# EAGLE design Controller_Keinz_2022 (EAGLE 9.4.2)

## Sheet 1 of 3
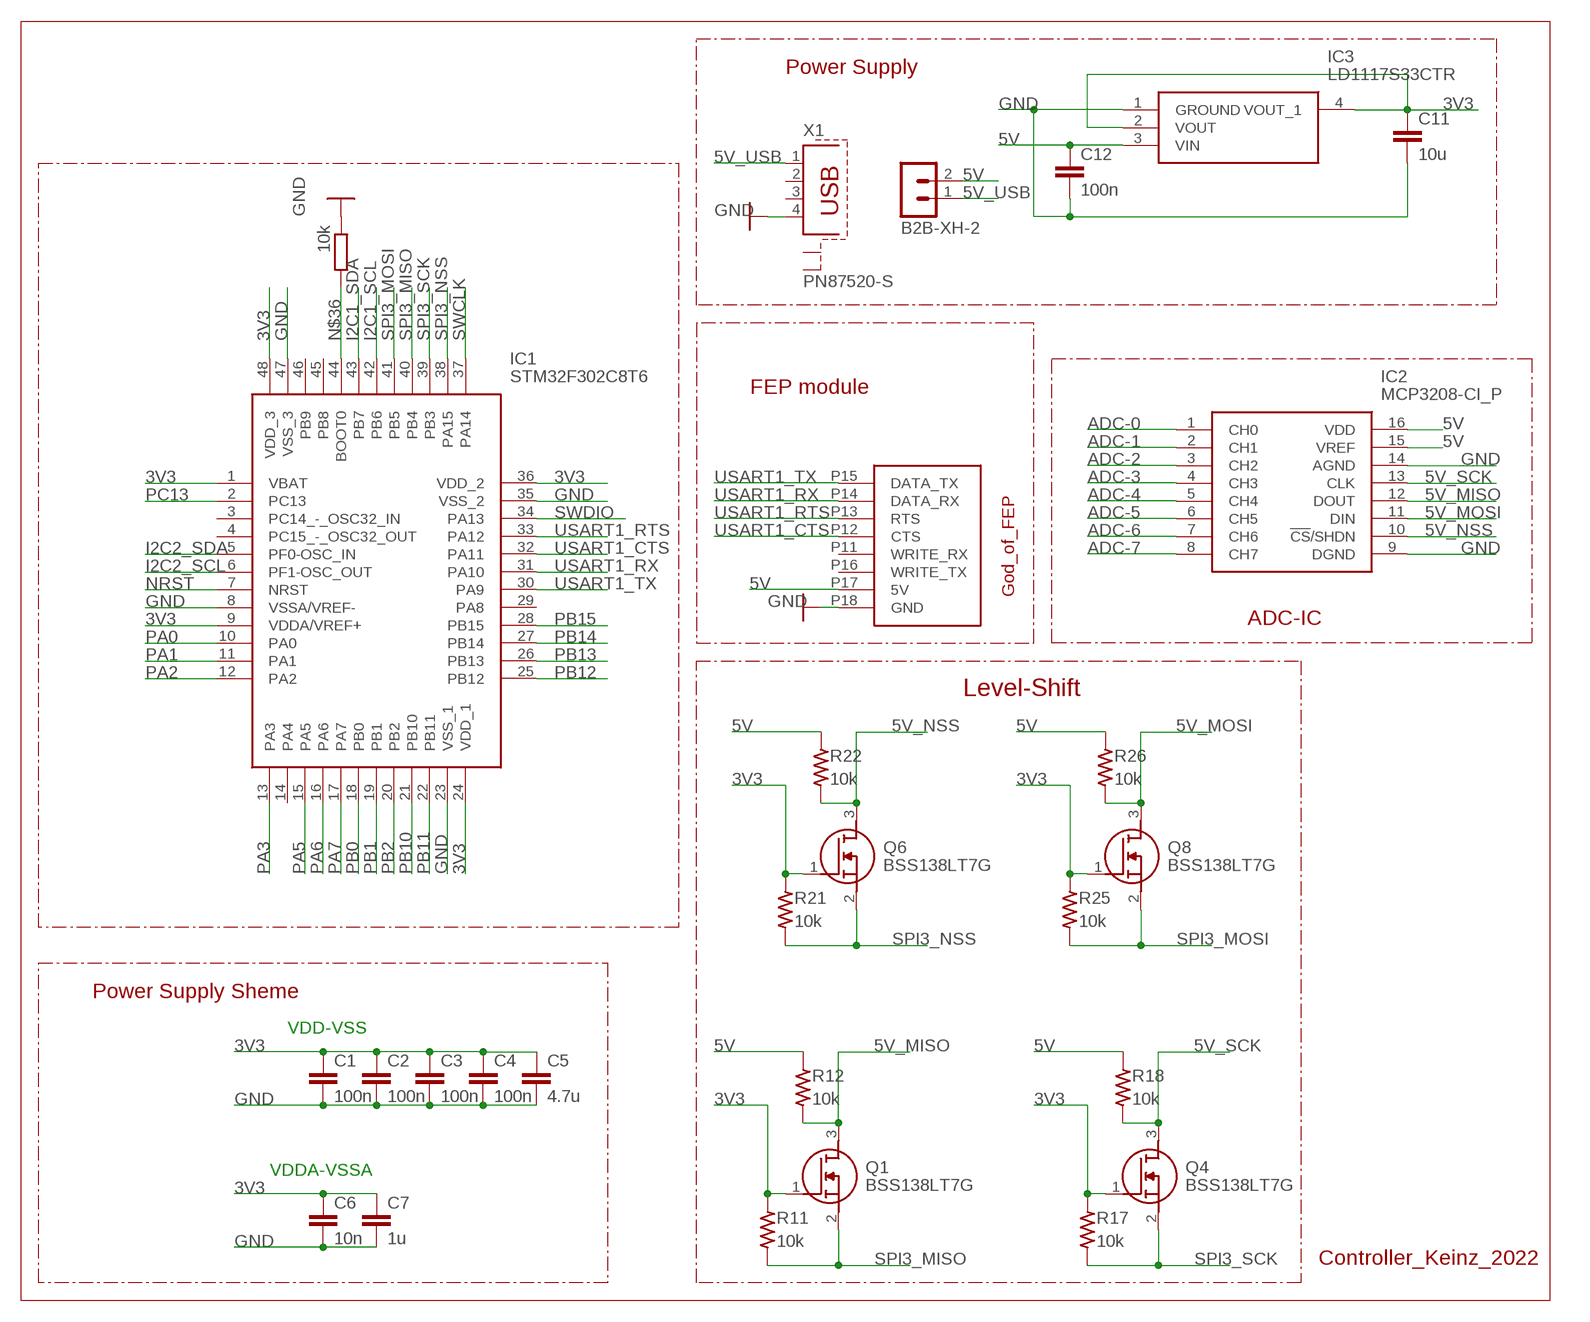
[diagram p0: schematic, sheet 1]

### Parts
C1  100n  C-EUC0603K  [C0603K]
C2  100n  C-EUC0603K  [C0603K]
C3  100n  C-EUC0603K  [C0603K]
C4  100n  C-EUC0603K  [C0603K]
C5  4.7u  C-EUC0603K  [C0603K]
C6  10n  C-EUC0603K  [C0603K]
C7  1u  C-EUC0603K  [C0603K]
C11  10u  C-EUC0603K  [C0603K]
C12  100n  C-EUC0603K  [C0603K]
FEP_1  GOD_OF_FEP  [GOD_OF_FEP]
IC1  STM32F302C8T6  [QFP50P900X900X160-48N]
IC2  MCP3208-CI_P  [DIP781W56P254L1918H533Q16N]
IC3  LD1117S33CTR  [SOT230P700X190-4N]
Q1  BSS138LT7G  [SOT96P237X111-3N]
Q4  BSS138LT7G  [SOT96P237X111-3N]
Q6  BSS138LT7G  [SOT96P237X111-3N]
Q8  BSS138LT7G  [SOT96P237X111-3N]
R8  10k  R-EU_R0603  [R0603@1]
R11  10k  RESISTOR-US1608  [SMD1608]
R12  10k  RESISTOR-US1608  [SMD1608]
R17  10k  RESISTOR-US1608  [SMD1608]
R18  10k  RESISTOR-US1608  [SMD1608]
R21  10k  RESISTOR-US1608  [SMD1608]
R22  10k  RESISTOR-US1608  [SMD1608]
R25  10k  RESISTOR-US1608  [SMD1608]
R26  10k  RESISTOR-US1608  [SMD1608]
X1  PN87520-S  [PN87520-S]
X22  B2B-XH-2  [B2B-XH-A]

### Nets
3V3: C1.1 C2.1 C3.1 C4.1 C5.1 C6.1 C7.1 C11.1 IC1.1(VBAT) IC1.9(VDDA/VREF+) IC1.24(VDD_1) IC1.36(VDD_2) IC1.48(VDD_3) IC3.2(VOUT) IC3.4(VOUT_1) Q1.1(G) Q4.1(G) Q6.1(G) Q8.1(G) R11.1 R17.1 R21.1 R25.1 ; also sheet 2,3
5V: C12.1 FEP_1.P17(5V) IC2.15(VREF) IC2.16(VDD) IC3.3(VIN) R12.1 R18.1 R22.1 R26.1 X22.2 ; also sheet 2,3
5V_MISO: IC2.12(DOUT) Q1.3(D) R12.2
5V_MOSI: IC2.11(DIN) Q8.3(D) R26.2
5V_NSS: IC2.10(!CS!/SHDN) Q6.3(D) R22.2
5V_SCK: IC2.13(CLK) Q4.3(D) R18.2
5V_USB: X1.1 X22.1
ADC-0: IC2.1(CH0) ; also sheet 2
ADC-1: IC2.2(CH1) ; also sheet 2
ADC-2: IC2.3(CH2) ; also sheet 2
ADC-3: IC2.4(CH3) ; also sheet 2
ADC-4: IC2.5(CH4) ; also sheet 2
ADC-5: IC2.6(CH5) ; also sheet 2
ADC-6: IC2.7(CH6) ; also sheet 2
ADC-7: IC2.8(CH7)
GND: C1.2 C2.2 C3.2 C4.2 C5.2 C6.2 C7.2 C11.2 C12.2 FEP_1.P18(GND) IC1.8(VSSA/VREF-) IC1.23(VSS_1) IC1.35(VSS_2) IC1.47(VSS_3) IC2.9(DGND) IC2.14(AGND) IC3.1(GROUND) R8.1 X1.4 ; also sheet 2,3
I2C1_SCL: IC1.42(PB6) ; also sheet 2
I2C1_SDA: IC1.43(PB7) ; also sheet 2
I2C2_SCL: IC1.6(PF1-OSC_OUT) ; also sheet 2
I2C2_SDA: IC1.5(PF0-OSC_IN) ; also sheet 2
N$36: IC1.44(BOOT0) R8.2
NRST: IC1.7(NRST) ; also sheet 2
PA0: IC1.10(PA0) ; also sheet 2
PA1: IC1.11(PA1) ; also sheet 3
PA2: IC1.12(PA2) ; also sheet 3
PA3: IC1.13(PA3) ; also sheet 2
PA5: IC1.15(PA5) ; also sheet 2
PA6: IC1.16(PA6) ; also sheet 2
PA7: IC1.17(PA7) ; also sheet 2
PB0: IC1.18(PB0) ; also sheet 2
PB1: IC1.19(PB1) ; also sheet 2
PB2: IC1.20(PB2) ; also sheet 2
PB10: IC1.21(PB10) ; also sheet 3
PB11: IC1.22(PB11) ; also sheet 3
PB12: IC1.25(PB12) ; also sheet 2
PB13: IC1.26(PB13) ; also sheet 3
PB14: IC1.27(PB14) ; also sheet 3
PB15: IC1.28(PB15) ; also sheet 3
PC13: IC1.2(PC13) ; also sheet 2
SPI3_MISO: IC1.40(PB4) Q1.2(S) R11.2
SPI3_MOSI: IC1.41(PB5) Q8.2(S) R25.2
SPI3_NSS: IC1.38(PA15) Q6.2(S) R21.2
SPI3_SCK: IC1.39(PB3) Q4.2(S) R17.2
SWCLK: IC1.37(PA14) ; also sheet 2
SWDIO: IC1.34(PA13) ; also sheet 2
USART1_CTS: FEP_1.P12(CTS) IC1.32(PA11)
USART1_RTS: FEP_1.P13(RTS) IC1.33(PA12)
USART1_RX: FEP_1.P14(DATA_RX) IC1.31(PA10)
USART1_TX: FEP_1.P15(DATA_TX) IC1.30(PA9)
Unconnected: FEP_1.P11(WRITE_RX) FEP_1.P16(WRITE_TX) IC1.3(PC14_-_OSC32_IN) IC1.4(PC15_-_OSC32_OUT) IC1.14(PA4) IC1.29(PA8) IC1.45(PB8) IC1.46(PB9) X1.2 X1.3 X1.S1 X1.S2

### Notes on the sheet
- Power Supply
- FEP module
- ADC-IC
- Level-Shift
- Power Supply Sheme
- VDD-VSS
- VDDA-VSSA
- Controller_Keinz_2022

## Sheet 2 of 3
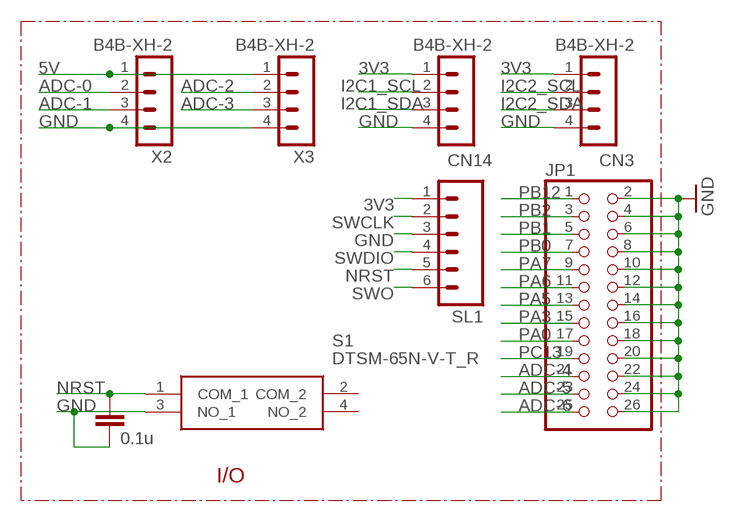
[diagram p1: schematic, sheet 2]

### Parts
C13  0.1u  C-EUC0603K  [C0603K]
CN3  B4B-XH-2  [B4B-XH-A]
CN14  B4B-XH-2  [B4B-XH-A]
JP1  PINHD-2X13  [2X13]
S1  DTSM-65N-V-T_R  [DTSM65NVTR]
SL1  MA06  [06PA]
X2  B4B-XH-2  [B4B-XH-A]
X3  B4B-XH-2  [B4B-XH-A]

### Nets
3V3: CN3.1 CN14.1 SL1.1 ; also sheet 1,3
5V: X2.1 X3.1 ; also sheet 1,3
ADC-0: X2.2 ; also sheet 1
ADC-1: X2.3 ; also sheet 1
ADC-2: X3.2 ; also sheet 1
ADC-3: X3.3 ; also sheet 1
ADC-4: JP1.21 ; also sheet 1
ADC-5: JP1.23 ; also sheet 1
ADC-6: JP1.25 ; also sheet 1
GND: C13.2 CN3.4 CN14.4 JP1.2 JP1.4 JP1.6 JP1.8 JP1.10 JP1.12 JP1.14 JP1.16 JP1.18 JP1.20 JP1.22 JP1.24 JP1.26 S1.3(NO_1) SL1.3 X2.4 X3.4 ; also sheet 1,3
I2C1_SCL: CN14.2 ; also sheet 1
I2C1_SDA: CN14.3 ; also sheet 1
I2C2_SCL: CN3.2 ; also sheet 1
I2C2_SDA: CN3.3 ; also sheet 1
NRST: C13.1 S1.1(COM_1) SL1.5 ; also sheet 1
PA0: JP1.17 ; also sheet 1
PA3: JP1.15 ; also sheet 1
PA5: JP1.13 ; also sheet 1
PA6: JP1.11 ; also sheet 1
PA7: JP1.9 ; also sheet 1
PB0: JP1.7 ; also sheet 1
PB1: JP1.5 ; also sheet 1
PB2: JP1.3 ; also sheet 1
PB12: JP1.1 ; also sheet 1
PC13: JP1.19 ; also sheet 1
SWCLK: SL1.2 ; also sheet 1
SWDIO: SL1.4 ; also sheet 1
SWO: SL1.6
Unconnected: S1.2(COM_2) S1.4(NO_2)

### Notes on the sheet
- I/O

## Sheet 3 of 3
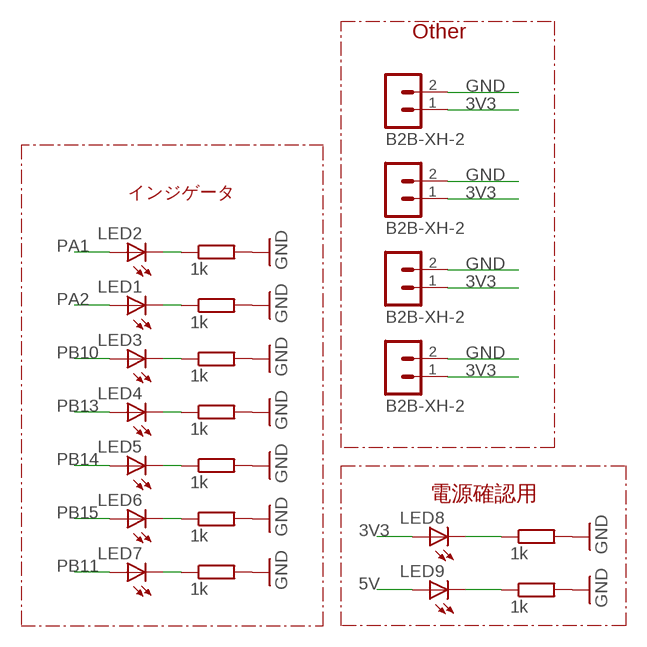
[diagram p2: schematic, sheet 3]

### Parts
LED1  LEDCHIP-LED0805  [CHIP-LED0805]
LED2  LEDCHIP-LED0805  [CHIP-LED0805]
LED3  LEDCHIP-LED0805  [CHIP-LED0805]
LED4  LEDCHIP-LED0805  [CHIP-LED0805]
LED5  LEDCHIP-LED0805  [CHIP-LED0805]
LED6  LEDCHIP-LED0805  [CHIP-LED0805]
LED7  LEDCHIP-LED0805  [CHIP-LED0805]
LED8  LEDCHIP-LED0805  [CHIP-LED0805]
LED9  LEDCHIP-LED0805  [CHIP-LED0805]
R1  1k  R-EU_R0603  [R0603@1]
R2  1k  R-EU_R0603  [R0603@1]
R3  1k  R-EU_R0603  [R0603@1]
R4  1k  R-EU_R0603  [R0603@1]
R5  1k  R-EU_R0603  [R0603@1]
R6  1k  R-EU_R0603  [R0603@1]
R7  1k  R-EU_R0603  [R0603@1]
R9  1k  R-EU_R0603  [R0603@1]
R10  1k  R-EU_R0603  [R0603@1]
X4  B2B-XH-2  [B2B-XH-A]
X5  B2B-XH-2  [B2B-XH-A]
X6  B2B-XH-2  [B2B-XH-A]
X7  B2B-XH-2  [B2B-XH-A]

### Nets
3V3: LED8.A X4.1 X5.1 X6.1 X7.1 ; also sheet 1,2
5V: LED9.A ; also sheet 1,2
GND: R1.2 R2.2 R3.2 R4.2 R5.2 R6.2 R7.2 R9.2 R10.2 X4.2 X5.2 X6.2 X7.2 ; also sheet 1,2
N$1: LED2.C R1.1
N$2: LED1.C R2.1
N$3: LED3.C R3.1
N$4: LED4.C R4.1
N$5: LED5.C R5.1
N$6: LED6.C R6.1
N$7: LED7.C R7.1
N$9: LED9.C R10.1
N$10: LED8.C R9.1
PA1: LED2.A ; also sheet 1
PA2: LED1.A ; also sheet 1
PB10: LED3.A ; also sheet 1
PB11: LED7.A ; also sheet 1
PB13: LED4.A ; also sheet 1
PB14: LED5.A ; also sheet 1
PB15: LED6.A ; also sheet 1

### Notes on the sheet
- Other
- インジゲータ
- 電源確認用

## Library data of the parts
C1-C7 C11-C13 = rcl:C-EU: CAPACITOR, European symbol
CN3 CN14 X2 X3 = JST-XH:B4B-XH: JST XH series header 2.50mm pitch disconnectable crimp style connectors, vertical (side entry type), 4 pins
FEP_1 = God_of_FEP:GOD_OF_FEP
IC1 = SamacSys_Parts:STM32F302C8T6: STMICROELECTRONICS - STM32F302C8T6 - MCU, 32BIT, CORTEX-M4, 72MHZ, LQFP-48 Source: Datasheet <http://www.st.com/content/ccc/resource/technical/document/datasheet/e4/06/d5/04/58/af/41/14/DM00093333.pdf/files/DM00093333.pdf/jcr:content/translations/en.DM00093333.pdf>; ARROW_PART_NUMBER: STM32F302C8T6; ARROW_PRICE-STOCK: https://www.arrow.com/en/products/stm32f302c8t6/stmicroelectronics; DESCRIPTION: STMICROELECTRONICS - STM32F302C8T6 - MCU, 32BIT, CORTEX-M4, 72MHZ, LQFP-48; HEIGHT: 1.6mm; MANUFACTURER_NAME: STMicroelectronics; MANUFACTURER_PART_NUMBER: STM32F302C8T6; MOUSER_PART_NUMBER: 511-STM32F302C8T6; MOUSER_PRICE-STOCK: https://www.mouser.co.uk/ProductDetail/STMicroelectronics/STM32F302C8T6?qs=F5OEftmZcCDUtHR76ET77A%3D%3D
IC2 = SamacSys_Parts:MCP3208-CI_P: A/D Converters Source: Datasheet <https://eu.mouser.com/datasheet/2/268/21298e-1101808.pdf>; ARROW_PART_NUMBER: MCP3208-CI/P; ARROW_PRICE-STOCK: https://www.arrow.com/en/products/mcp3208-cip/microchip-technology?region=europe; DESCRIPTION: A/D Converters; HEIGHT: 5.334mm; MANUFACTURER_NAME: Microchip; MANUFACTURER_PART_NUMBER: MCP3208-CI/P; MOUSER_PART_NUMBER: 579-MCP3208CIP; MOUSER_PRICE-STOCK: https://www.mouser.co.uk/ProductDetail/Microchip-Technology/MCP3208-CI-P?qs=9y3LFqDLL8IuAGJEebQX9g%3D%3D
IC3 = SamacSys_Parts:LD1117S33CTR: LD1117S33CTR, Low Dropout Voltage Regulator, 1.3A, 3.3 V +/-1%, 4-Pin SOT-223 Source: Datasheet <http://www.st.com/st-web-ui/static/active/en/resource/technical/document/datasheet/CD00000544.pdf>; ALLIED_NUMBER: 70390200; ALLIED_PRICE-STOCK: http://www.alliedelec.com/stmicroelectronics-ld1117s33ctr/70390200/; DESCRIPTION: LD1117S33CTR, Low Dropout Voltage Regulator, 1.3A, 3.3 V +/-1%, 4-Pin SOT-223; HEIGHT: 1.9mm; MANUFACTURER_NAME: STMicroelectronics; MANUFACTURER_PART_NUMBER: LD1117S33CTR; MOUSER_PART_NUMBER: 511-LD1117S33C; MOUSER_PRICE-STOCK: https://www.mouser.com/Search/Refine.aspx?Keyword=511-LD1117S33C; RS_PART_NUMBER: 6869388P; RS_PRICE-STOCK: http://uk.rs-online.com/web/p/products/6869388P
JP1 = pinhead:PINHD-2X13: PIN HEADER
LED1-LED9 = adafruit:LED: LED OSRAM: - CHIPLED LG R971, LG N971, LY N971, LG Q971, LY Q971, LO R971, LY R971 LH N974, LH R974 LS Q976, LO Q976, LY Q976 LO Q996 - Hyper CHIPLED LW Q18S LB Q993, LB Q99A, LB R99A - SideLED LS A670, LO A670, LY A670, LG A670, LP A670 LB A673, LV A673, LT A673, LW A673 LH A674 LY A675 LS A676, LA A676, LO A676, LY A676, LW A676 LS A679, LY A679, LG A679 - Hyper Micro SIDELED® LS Y876, LA Y876, LO Y876, LY Y876 LT Y87S - SmartLED LW L88C, LW L88S LB L89C, LB L89S, LG L890 LS L89K, LO L89K, LY L89K LS L896, LA L896, LO L896, LY L896 - TOPLED LS T670, LO T670, LY T670, LG T670, LP T670 LSG T670, LSP T670, LSY T670, LOP T670, LYG T670 LG T671, LOG T671, LSG T671 LB T673, LV T673, LT T673, LW T673 LH T674 LS T676, LA T676, LO T676, LY T676, LB T676, LH T676, LSB T676, LW T676 LB T67C, LV T67C, LT T67C, LS T67K, LO T67K, LY T67K, LW E67C LS E67B, LA E67B, LO E67B, LY E67B, LB E67C, LV E67C, LT E67C LW T67C LS T679, LY T679, LG T679 LS T770, LO T770, LY T770, LG T770, LP T770 LB T773, LV T773, LT T773, LW T773 LH T774 LS E675, LA E675, LY E675, LS T675 LS T776, LA T776, LO T776, LY T776, LB T776 LHGB T686 LT T68C, LB T68C - Hyper Mini TOPLED® LB M676 - Mini TOPLED Santana® LG M470 LS M47K, LO M47K, LY M47K Source: http://www.osram.convergy.de/
Q1 Q4 Q6 Q8 = SamacSys_Parts:BSS138LT7G: MOSFET Single N-Channel Logic Level Power MOSFET 50V, 200mA, 3.5 Source: Datasheet <https://www.mouser.com/datasheet/2/308/BSS138LT1-D-1522521.pdf>; ARROW_PART_NUMBER: BSS138LT7G; ARROW_PRICE-STOCK: https://www.arrow.com/en/products/bss138lt7g/on-semiconductor; DESCRIPTION: MOSFET Single N-Channel Logic Level Power MOSFET 50V, 200mA, 3.5; HEIGHT: 1.11mm; MANUFACTURER_NAME: ON Semiconductor; MANUFACTURER_PART_NUMBER: BSS138LT7G; MOUSER_PART_NUMBER: 863-BSS138LT7G; MOUSER_PRICE-STOCK: https://www.mouser.co.uk/ProductDetail/ON-Semiconductor/BSS138LT7G/?qs=l7cgNqFNU1gVGpXKtqpwiw%3D%3D
R1-R10 = rcl:R-EU_: RESISTOR, European symbol; SPICEPREFIX: R
R11 R12 R17 R18 R21 R22 R25 R26 = generic:RESISTOR-US: Generic Registor
S1 = SamacSys_Parts:DTSM-65N-V-T_R: Tactile Switches Surface Mounting Type 6*6 Source: Datasheet <https://componentsearchengine.com/Datasheets/1/DTSM-65N-V-T_R.pdf>; DESCRIPTION: Tactile Switches Surface Mounting Type 6*6; HEIGHT: 9.6mm; MANUFACTURER_NAME: Diptronics; MANUFACTURER_PART_NUMBER: DTSM-65N-V-T/R; MOUSER_PART_NUMBER: 113-DTSM-65N-V-T/R; MOUSER_PRICE-STOCK: https://www.mouser.com/Search/Refine.aspx?Keyword=113-DTSM-65N-V-T%2FR
SL1 = con-amp-quick:MA06: AMP QUICK CONNECTOR; OC_FARNELL: unknown; OC_NEWARK: unknown
X1 = con-berg:PN87520-S; OC_FARNELL: unknown; OC_NEWARK: unknown
X4-X7 X22 = con-JST_XH:B2B-XH: JST XH series header 2.50mm pitch disconnectable crimp style connectors, vertical (side entry type), 2 pins

## Board
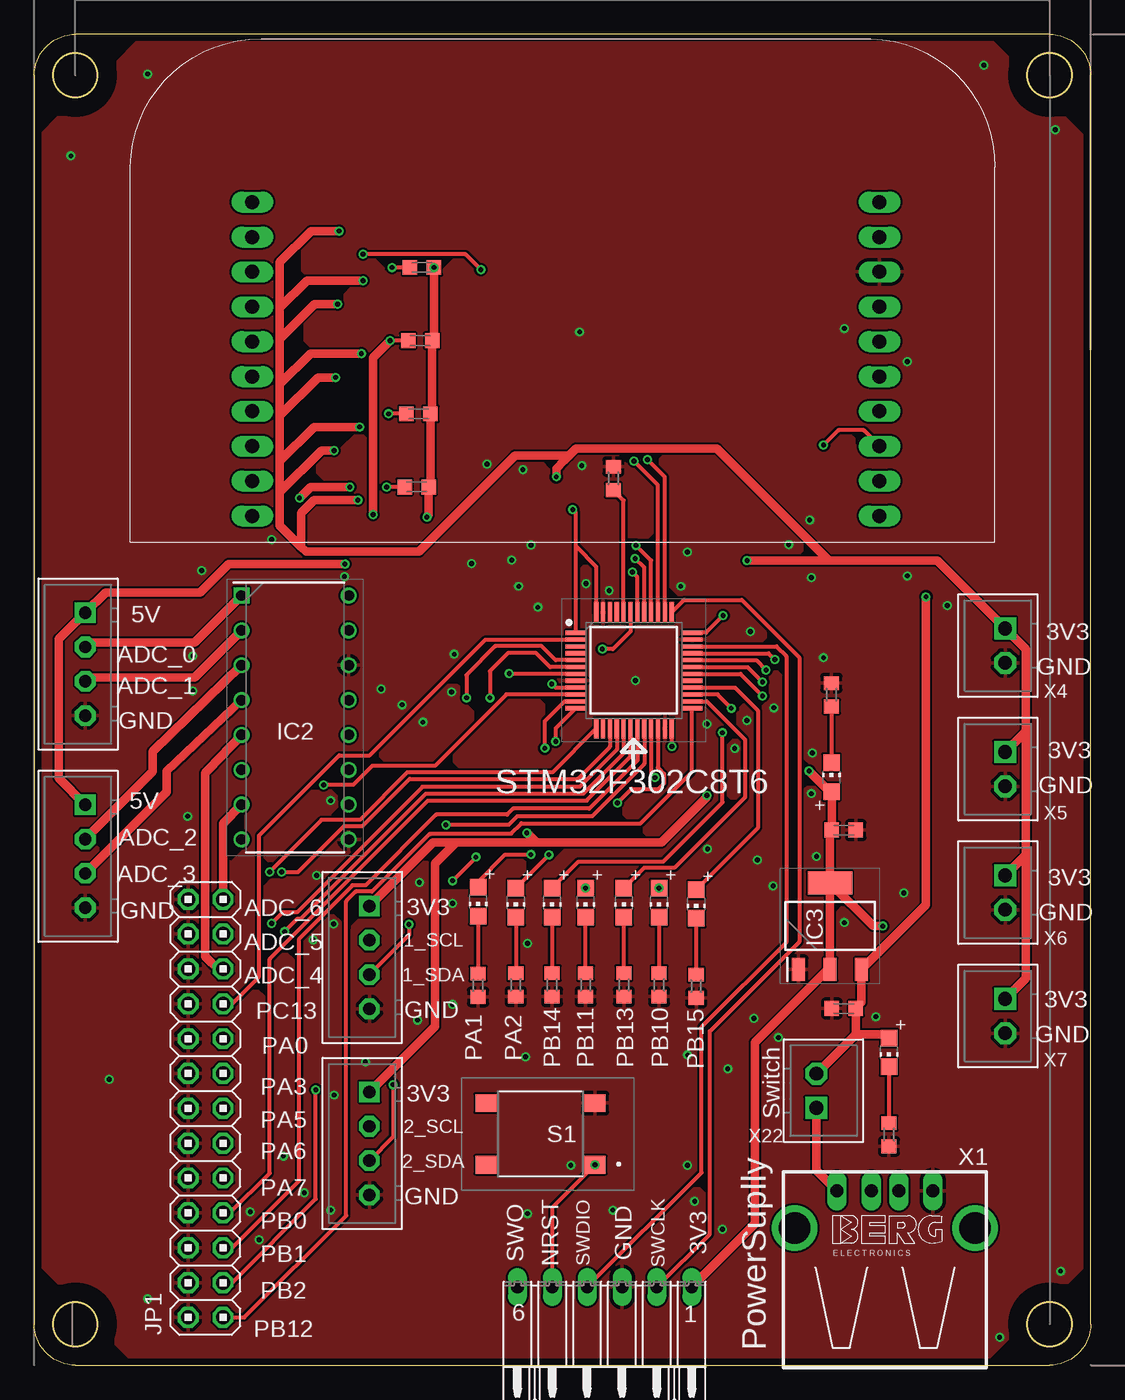
[diagram p3: board, top side]
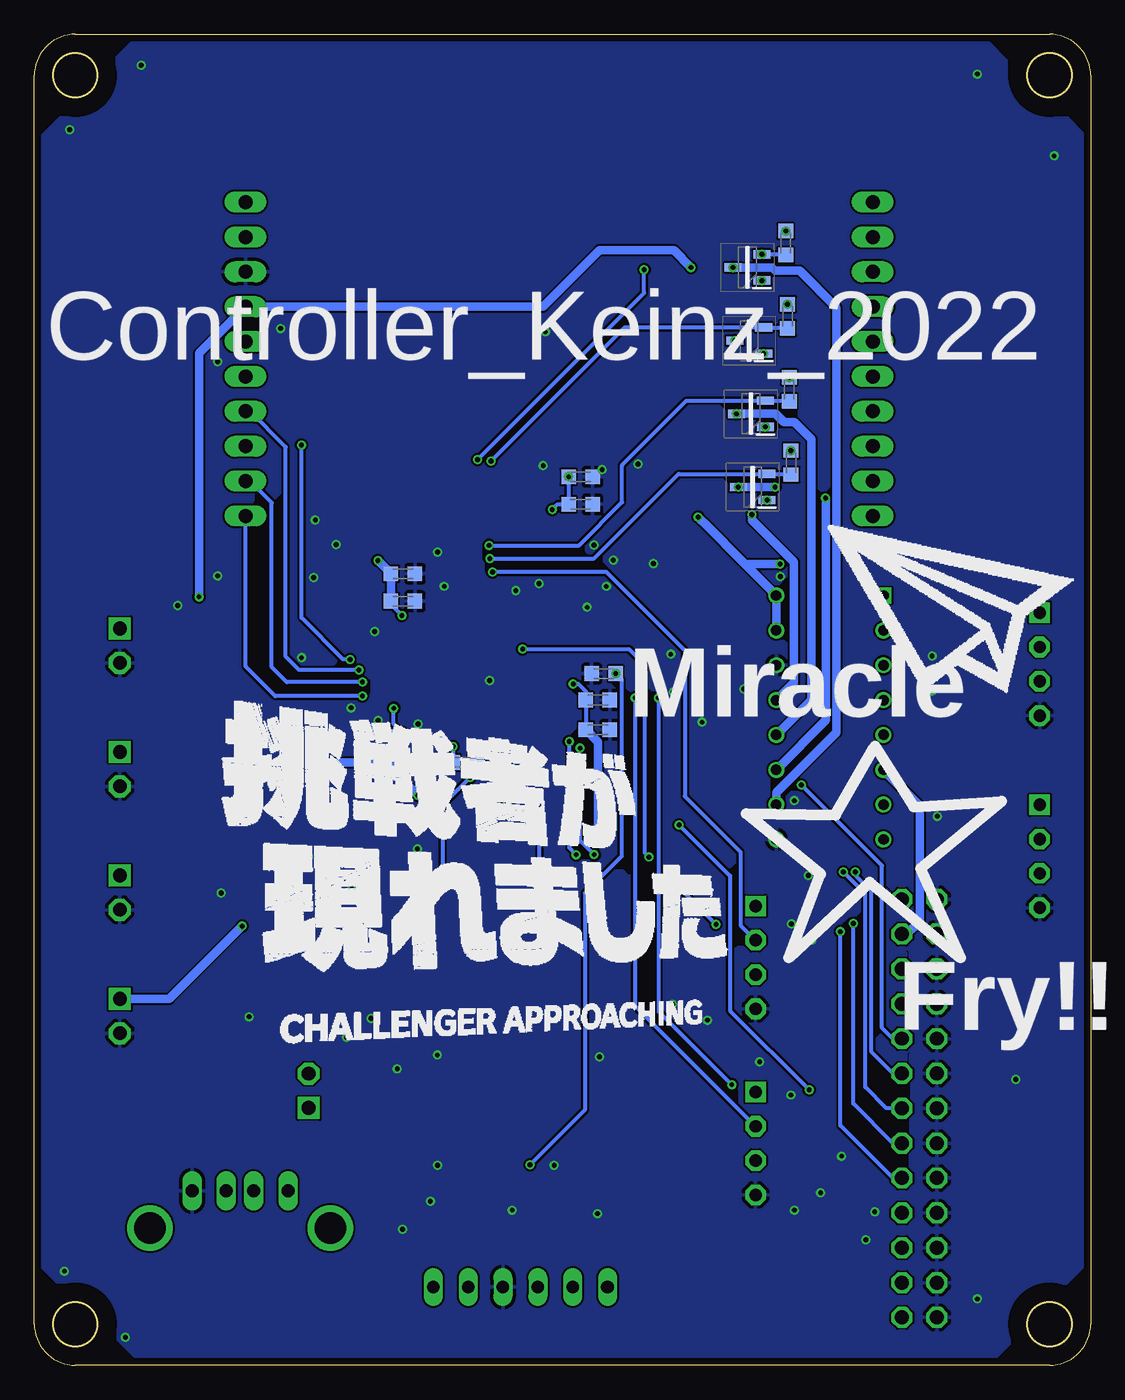
[diagram p4: board, bottom side, seen from below]

Size 77 x 97 mm. Coordinates in mm from the lower left corner, seen from the top.
Outline: 3,0 74,0 arc90 77,3 77,94 arc90 74,97 3,97 arc90 0,94 0,3 arc90 3,0
Outline: circle at 3,94 radius 1.6
Outline: circle at 74,94 radius 1.6
Outline: circle at 74,3 radius 1.6
Outline: circle at 3,3 radius 1.6
Copper layers (1*16): Top 0.035mm / dielectric 1.6mm / Bottom 0.035mm
Design rules "Elecrow_2-layer_PCB_eagle_rule": minimum track width 6mil, minimum drill 12mil, track to track 6mil, track to pad 6mil, pad to pad 6mil, via to via 8mil, smd to smd 0mil, copper to edge 20mil, drill to drill 10mil, minimum pad ring 6mil, minimum via ring 6mil, stop-mask expansion 0mil, vias tented up to drill 100mil, thermal gap 10mil
tRestrict: area 71,0 to 77,6; area 0,91 to 6,97; area 71,91 to 77,97; area 0,0 to 6,6; 119 lines
bRestrict: area 0,91 to 6,97; area 71,0 to 77,6; area 71,91 to 77,97; area 0,0 to 6,6; 104 lines

### Footprints (pad centres in the part's own frame; a part is rotated, then mirrored left to right if it is on the bottom)
C0603K = smd 1.05 x 1.08: 1 -0.875,0; 2 0.875,0
B4B-XH-A = drill 0.9 pad 1.5 square: 1 3.75,0 | drill 0.9 pad 1.5 octagon: 2 1.25,0; 3 -1.25,0; 4 -3.75,0
GOD_OF_FEP = drill 1.02 long: P1 8.89,9.525; P2 8.89,6.985; P3 8.89,4.445; P4 8.89,1.905; P5 8.89,14.605; P6 8.89,17.145; P7 8.89,19.685; P8 8.89,22.225; P9 8.89,24.765; P10 8.89,12.065; P11 54.61,12.065; P12 54.61,9.525; P13 54.61,6.985; P14 54.61,4.445; P15 54.61,1.905; P16 54.61,14.605; P17 54.61,17.145; P18 54.61,19.685; P19 54.61,22.225; P20 54.61,24.765
QFP50P900X900X160-48N = smd 1.475 x 0.3: 1 -4.238,2.75; 2 -4.238,2.25; 3 -4.238,1.75; 4 -4.238,1.25; 5 -4.238,0.75; 6 -4.238,0.25; 7 -4.238,-0.25; 8 -4.238,-0.75; 9 -4.238,-1.25; 10 -4.238,-1.75; 11 -4.238,-2.25; 12 -4.238,-2.75; 25 4.238,-2.75; 26 4.238,-2.25; 27 4.238,-1.75; 28 4.238,-1.25; 29 4.238,-0.75; 30 4.238,-0.25; 31 4.238,0.25; 32 4.238,0.75; 33 4.238,1.25; 34 4.238,1.75; 35 4.238,2.25; 36 4.238,2.75 | smd 0.3 x 1.475: 13 -2.75,-4.238; 14 -2.25,-4.238; 15 -1.75,-4.238; 16 -1.25,-4.238; 17 -0.75,-4.238; 18 -0.25,-4.238; 19 0.25,-4.238; 20 0.75,-4.238; 21 1.25,-4.238; 22 1.75,-4.238; 23 2.25,-4.238; 24 2.75,-4.238; 37 2.75,4.238; 38 2.25,4.238; 39 1.75,4.238; 40 1.25,4.238; 41 0.75,4.238; 42 0.25,4.238; 43 -0.25,4.238; 44 -0.75,4.238; 45 -1.25,4.238; 46 -1.75,4.238; 47 -2.25,4.238; 48 -2.75,4.238
DIP781W56P254L1918H533Q16N = drill 0.759 pad 1.159 square: 1 -3.905,8.89 | drill 0.759 pad 1.159: 2 -3.905,6.35; 3 -3.905,3.81; 4 -3.905,1.27; 5 -3.905,-1.27; 6 -3.905,-3.81; 7 -3.905,-6.35; 8 -3.905,-8.89; 9 3.905,-8.89; 10 3.905,-6.35; 11 3.905,-3.81; 12 3.905,-1.27; 13 3.905,1.27; 14 3.905,3.81; 15 3.905,6.35; 16 3.905,8.89
SOT230P700X190-4N = smd 1.65 x 0.95: 1 -3.15,2.3; 2 -3.15,0; 3 -3.15,-2.3 | smd 1.65 x 3.25: 4 3.15,0
2X13 = drill 1.016 octagon: 1 -15.24,-1.27; 2 -15.24,1.27; 3 -12.7,-1.27; 4 -12.7,1.27; 5 -10.16,-1.27; 6 -10.16,1.27; 7 -7.62,-1.27; 8 -7.62,1.27; 9 -5.08,-1.27; 10 -5.08,1.27; 11 -2.54,-1.27; 12 -2.54,1.27; 13 0,-1.27; 14 0,1.27; 15 2.54,-1.27; 16 2.54,1.27; 17 5.08,-1.27; 18 5.08,1.27; 19 7.62,-1.27; 20 7.62,1.27; 21 10.16,-1.27; 22 10.16,1.27; 23 12.7,-1.27; 24 12.7,1.27; 25 15.24,-1.27; 26 15.24,1.27
CHIP-LED0805 = smd 1.2 x 1.2: A 0,-1.05; C 0,1.05
SOT96P237X111-3N = smd 1.25 x 0.6: 1 -1.05,0.955; 2 -1.05,-0.955; 3 1.05,0
R0603@1 = smd 1 x 1.1: 1 -0.85,0; 2 0.85,0
SMD1608 = smd 1.05 x 1.08: 1 -0.875,0; 2 0.875,0
DTSM65NVTR = smd 1.55 x 1.3: 1 -3.975,2.25; 2 3.975,2.25; 3 -3.975,-2.25; 4 3.975,-2.25
06PA = drill 0.914 long: 1 -6.35,0; 2 -3.81,0; 3 -1.27,0; 4 1.27,0; 5 3.81,0; 6 6.35,0
PN87520-S = drill 0.95 long: 1 -3.5,2.71; 2 -1,2.71; 3 1,2.71; 4 3.5,2.71 | drill 2.3 pad 2.9: S1 -6.57,0; S2 6.57,0
B2B-XH-A = drill 1 pad 1.6 square: 1 1.25,0 | drill 1 pad 1.6 octagon: 2 -1.25,0

### Placement (x,y rotation side)
C1  50.13,57.69 0 bottom
C2  50.13,55.69 0 bottom
C3  37.18,64.75 0 bottom
C4  37.18,62.75 0 bottom
C5  45.62,43.94 0 bottom
C6  35.92,48.48 0 bottom
C7  35.92,46.32 0 bottom
C11  59,39 0 top
C12  59,26 180 top
C13  35.49,50.4 180 bottom
CN3  24.43,16.16 90 top
CN14  24.43,29.72 90 top
FEP_1  7,60 0 top
IC1  43.71,50.63 0 top
IC2  19.01,47.21 0 top
IC3  58,32 90 top
JP1  12.48,18.72 90 top
LED1  35.1,33.72 180 top
LED2  32.35,33.78 180 top
LED3  45.54,33.72 180 top
LED4  42.98,33.72 180 top
LED5  37.74,33.72 180 top
LED6  48.25,33.62 180 top
LED7  40.19,33.72 180 top
LED8  58.1,42.86 0 top
LED9  62.3,22.8 180 top
Q1  24.77,69.34 180 bottom
Q4  24.89,74.68 180 bottom
Q6  25.02,80.01 180 bottom
Q8  24.64,64.01 180 bottom
R1  32.35,27.69 270 top
R2  35.1,27.72 270 top
R3  45.54,27.72 270 top
R4  42.98,27.72 270 top
R5  37.74,27.72 270 top
R6  48.25,27.62 270 top
R7  40.19,27.72 270 top
R8  42.21,64.64 270 top
R9  58.1,48.86 90 top
R10  62.3,16.8 270 top
R11  21.97,71.12 270 bottom
R12  28,69.34 180 top
R17  22.1,76.45 270 bottom
R18  28.13,74.68 180 top
R21  22.23,81.79 270 bottom
R22  28.26,80.01 180 top
R25  21.84,65.79 270 bottom
R26  27.88,64.01 180 top
S1  36.9,16.86 180 top
SL1  41.57,5.7 180 top
X1  62,10 0 top
X2  3.71,51.09 90 top
X3  3.71,37.09 90 top
X4  70.76,52.44 90 top
X5  70.76,43.44 90 top
X6  70.76,34.44 90 top
X7  70.76,25.44 90 top
X22  57,20 270 top

### Tracks (layer width: path | path; a pad name or v marks a point on that pad's centre or on a via)
3V3  (via drill 0.35)
  Top 0.305: v50.21,54.63 48.96,53.38 IC1.36 | IC1.1 39.47,59.69 | v39.24,62.36 39.47,62.13 39.47,59.69 | IC1.24 46.46,45.11 v46.48,45.09 | 39.47,59.69 40.96,58.2 IC1.48 | v37.72,49.66 37.99,49.38 IC1.9
  Top 0.61: IC3.4 58,29 | 58,29 IC3.2 | IC3.4 58,38.88 C11.1 58.12,41.79 LED8.A 57.97,41.81 v56.47,43.31 | 58,29 52.54,23.54 52.54,10.31 SL1.1 | 57.93,58.63 49.76,66.8 39.5,66.8 38.99,66.29 | 72.26,46.2 X5.1 | 72.26,46.2 72.26,52.19 X4.1 65.82,58.63 57.93,58.63 | 72.26,46.2 72.26,37.2 | X6.1 72.26,37.2 | 72.26,37.2 72.26,28.2 X7.1 | CN14.1 29.06,38.1 30.73,38.1 | 36.6,38.1 45.72,38.1 49.02,41.4 v49.02,41.53 | IC3.4 61.15,32 v61.85,32 | 38.99,66.29 38.61,65.91 38.05,65.36 C3.1 | 30.73,38.1 29.21,36.58 29.21,24.69 CN3.1 | 38.99,66.29 38.98,66.3 35.05,66.3 28.03,59.28 19.8,59.28 19.44,59.64 | 57.93,58.63 v51.95,58.63 | 30.73,38.1 36.6,38.1 | Q8.1 20.38,63.05 19.44,62.11 19.44,59.64 | 17.9,63.62 20.94,66.66 R25.1 | Q1.1 20.38,68.39 17.9,65.91 | R11.1 20.69,72 17.9,69.21 | Q4.1 20.13,73.72 17.9,71.49 | R17.1 20.43,77.33 17.9,74.8 | Q6.1 19.87,79.06 17.9,77.08 | R21.1 20.18,82.66 17.9,80.38 17.9,77.08 | 36.6,38.1 v35.9,38.8 | 19.44,59.64 17.9,61.18 17.9,63.62 | 17.9,71.49 17.9,74.8 | 17.9,74.8 17.9,77.08 | 17.9,65.91 17.9,63.62 | 17.9,69.21 17.9,65.91 | 17.9,71.49 17.9,69.21
  Bottom 0.305: C3.1 C4.1 38.85,62.75 v39.24,62.36 | C2.1 51.01,55.43 v50.21,54.63 | C7.1 C6.1 36.8,49.11 37.34,49.66 v37.72,49.66 | v46.48,45.09 46.48,43.95 C5.1
  Bottom 0.61: v49.02,41.53 51.44,43.94 52.07,43.94 | 52.07,43.94 55.84,43.94 v56.47,43.31 | v61.85,32 67.16,26.69 X7.1 | C5.1 52.07,43.94 | v51.95,58.63 C1.1 C2.1 | v35.9,38.8 35.9,45.42 C7.1
  other vias: 23.59,63.05 21.84,66.66 23.71,68.39 21.97,72 23.84,73.72 22.1,77.33 23.97,79.06 22.23,82.66 38.05,64.75
5V  (via drill 0.35)
  Top 0.61: X22.2 59.88,24.12 | 59.88,24.12 C12.1 60.3,26.43 IC3.3 65,33.55 v65,56 | 59.88,24.12 62.02,24.12 LED9.A | R22.1 29.13,74.8 R18.1 29.01,69.47 R12.1 28.88,64.14 R26.1 28.75,61.95 v28.61,61.81 | v22.64,58.4 14.16,58.4 12.08,56.32 5.19,56.32 X2.1 1.78,52.91 1.78,42.78 X3.1
  Bottom 0.61: IC2.15 IC2.16 25.45,58.63 | 25.45,58.63 27.91,61.11 v28.61,61.81 | v65,56 65,73.75 FEP_1.P17 39.92,77.14 35.81,81.25 30.38,81.25 R22.1 | 25.45,58.63 25.21,58.4 v22.64,58.4
  other vias: 29.13,80.01
5V_MISO  (via drill 0.35)
  Top 0.305: R12.2 Q1.3
  Bottom 0.61: Q1.3 22.99,69.34 22.36,68.72 21.6,68.72 20.37,67.48 20.37,48.49 IC2.12
  other vias: 25.82,69.34
5V_MOSI  (via drill 0.35)
  Top 0.305: R26.2 Q8.3
  Top 0.61: v19.33,63.2 20.14,64.01 v23,64.01
  Bottom 0.61: IC2.11 19.3,47.01 19.3,63.2 v19.33,63.2 | v23,64.01 Q8.3
  other vias: 25.69,64.01
5V_NSS  (via drill 0.35)
  Top 0.305: R22.2 Q6.3
  Bottom 0.61: IC2.10 22.92,41.73 18.54,46.1 18.54,77.09 21.21,79.76 22.99,79.76 23.24,80.01 Q6.3
  other vias: 26.07,80.01
5V_SCK  (via drill 0.35)
  Top 0.305: R18.2 Q4.3
  Top 0.61: v24.7,62 24.7,73.43 Q4.3
  Bottom 0.61: IC2.13 21.65,49.75 21.65,58.55 24.7,61.6 v24.7,62
  other vias: 25.94,74.68
5V_USB
  Top 0.61: X1.1 57,14.21 X22.1
ADC-0
  Top 0.61: IC2.1 11.68,52.67 4.04,52.67 X2.2
ADC-1
  Top 0.61: IC2.2 11.68,50.13 4,50.13 X2.3
ADC-2
  Top 0.61: IC2.3 8.64,44.74 8.64,43.27 X3.2
ADC-3
  Top 0.61: IC2.4 9.65,43.29 9.65,41.78 X3.3
ADC-4
  Top 0.61: IC2.5 12.7,43.41 12.47,43.18 12.47,30.96 12.47,29.8 12.94,29.34 13.39,28.88 JP1.21
ADC-5
  Bottom 0.61: IC2.6 12.46,40.75 12.46,32.35 13.39,31.42 JP1.23
ADC-6
  Top 0.61: JP1.25 13.75,39.5 IC2.7
GND  (via drill 0.35)
  other vias: 43.81,49.91 54.99,59.82 47.12,56.77 52.2,53.47 49.02,46.74 51.05,44.96 51.94,46.99 49.08,37.62 24.13,22.1 18.16,15.24 35.94,30.73 50.16,9.91 48.13,11.94 52.45,25.27 50.55,21.59 61.34,25.4 35.94,11.05 70.36,2.03 74.8,6.86 66.55,55.37 63.63,73.15 74.42,90.04 69.22,94.74 8.26,94.11 2.67,88.14 12.19,57.91 31.88,58.42 47.61,59.27 35.31,56.77 30.61,51.82 56.64,41.66 36.7,55.24 34.8,58.67 25.27,49.28 26.8,48.13 28.32,46.86 21.59,41.15 20.32,30.99 15.75,11.18 16.38,9.14 19.68,12.57 21.59,11.3 21.84,19.68 28.07,35.18 30.48,33.66 27.94,25.15 30.48,26.29 35.81,22.48 47.62,22.61 42.16,11.3 54.23,23.88 59.05,32.26 57.02,37.08 52.7,36.83 53.85,34.92 63.63,57.53 56.64,57.4 57.53,51.56 56.52,61.59 59.05,75.56 39.75,75.31 63.37,34.42 20.57,35.69 11.18,40.01 11.56,49.15 11.56,51.69 5.46,20.83 8.26,4.83 40.21,56.97 41.91,56.47 39.91,65.57 35.61,65.27 36.21,59.77 33.01,65.67 22.61,57.47 17.31,60.17 21.81,32.17 39.11,14.57 47.61,14.57 30.42,49.06 53.91,47.91 56.72,44.61
  pour Top: 0,97 77,97 77,0 0,0
  pour Bottom: 0,97 77,97 77,0 0,0
I2C1_SCL  (via drill 0.35)
  Top 0.305: IC1.42 43.96,57.44 v43.6,57.8
  Bottom 0.305: CN14.2 25.53,32.07 25.53,37.4 29.59,41.46 29.59,52.1 35.29,57.8 v43.6,57.8
I2C1_SDA  (via drill 0.35)
  Top 0.305: v27.3,32.13 27.3,31.34 CN14.3 | IC1.43 43.46,53.49 42.16,52.2 v41.4,52.2 | v30.48,35.31 v32.19,37.02 v32.19,37.03
  Bottom 0.305: v27.3,32.13 v30.48,35.31 | v32.19,37.03 32.51,37.35 32.51,51.05 33.66,52.2 v41.4,52.2
I2C2_SCL  (via drill 0.35)
  Top 0.305: v33.2,48.64 33.2,50.58 34.52,51.9 36.59,51.9 37.6,50.88 IC1.6
  Bottom 0.305: v33.2,48.64 33.2,26.18 CN3.2
I2C2_SDA  (via drill 0.35)
  Top 0.305: v26.16,20.45 26.16,16.64 CN3.3 | v31.5,48.64 31.5,50.3 33.6,52.4 36.98,52.4 38,51.38 IC1.5
  Bottom 0.305: v31.5,48.64 31.5,25.78 v26.16,20.45
N$1
  Top 0.305: LED2.C R1.1
N$2
  Top 0.305: LED1.C R2.1
N$3
  Top 0.305: LED3.C R3.1
N$4
  Top 0.305: R4.1 LED4.C
N$5
  Top 0.305: LED5.C R5.1
N$6
  Top 0.305: R6.1 LED6.C
N$7
  Top 0.305: R7.1 LED7.C
N$9
  Top 0.305: LED9.C R10.1
N$10
  Top 0.305: R9.1 LED8.C
N$36
  Top 0.305: IC1.44 42.96,63.03 R8.2
NRST  (via drill 0.35)
  Top 0.305: SL1.5 37.76,11.49 S1.1 | IC1.7 34.64,50.38 C13.1
  Bottom 0.305: C13.1 34.19,49.98 34.19,37.09 36.87,34.42 36.87,18.61 S1.1
  other vias: 34.62,50.4 40.88,14.61
PA0  (via drill 0.35)
  Top 0.305: IC1.10 34.41,48.88 29.21,43.69 24.64,43.69 23.24,42.29 v21.08,42.29
  Bottom 0.305: v21.08,42.29 15.21,36.42 15.21,24.59 14.42,23.8 JP1.17
PA1  (via drill 0.35)
  Top 0.305: v37.21,44.97 37.21,46.95 38.65,48.38 IC1.11 | v36.19,37.21 34.33,37.21 32.35,35.23 LED2.A
  Bottom 0.305: v36.19,37.21 37.21,38.23 v37.21,44.97
PA2  (via drill 0.35)
  Top 0.305: IC1.12 38.01,46.42 v38.01,45.46 | LED1.A 37.5,37.17 v37.5,37.2
  Bottom 0.305: v37.5,37.2 38.01,37.7 v38.01,45.46
PA3  (via drill 0.35)
  Top 0.305: IC1.13 37.76,43.2 27.18,43.2 23.73,39.75 20.94,39.75 v17.14,35.96
  Bottom 0.305: v17.14,35.96 17.14,35.71 15.98,34.55 15.98,22.82 14.42,21.26 JP1.15
PA5  (via drill 0.35)
  Top 0.305: IC1.15 41.96,45.07 39.62,42.74 27.36,42.74 23.92,39.29 22.58,39.29 19.23,35.95 v18.03,35.95
  Bottom 0.305: v18.03,35.95 16.44,34.36 16.44,20.28 14.88,18.72 JP1.13
PA6  (via drill 0.35)
  Top 0.305: IC1.16 42.46,44.86 39.75,42.16 28.3,42.16 19.16,33.01 18.12,33.01 v17.3,32.2
  Bottom 0.305: v17.3,32.2 17.3,19.07 14.42,16.18 JP1.11
PA7  (via drill 0.35)
  Top 0.305: IC1.17 42.96,44.59 40.01,41.64 28.53,41.64 19.45,32.55 19.2,32.55 v18.25,31.6
  Bottom 0.305: v18.25,31.6 18.25,17.47 14.42,13.64 JP1.9
PB0
  Top 0.305: IC1.18 43.43,46.37 43.43,44.32 40.26,41.15 28.69,41.15 17.15,29.61 17.15,14 14.25,11.1 JP1.7
PB1
  Top 0.305: IC1.19 43.96,44.07 40.46,40.57 34.9,40.57 34.46,40.13 29.3,40.13 24.15,34.98 23.2,34.98 19.3,31.08 19.3,13.45 14.42,8.56 JP1.5
PB2  (via drill 0.35)
  Top 0.305: v20.52,20.07 20.52,12.12 14.42,6.02 JP1.3 | IC1.20 44.46,43.82 40.64,40.01 35.2,40.01 34.58,39.38 v30,39.38
  Bottom 0.305: v20.52,20.07 26.29,25.84 26.29,35.67 v30,39.38
PB10  (via drill 0.35)
  Top 0.305: IC1.21 44.96,43.11 v45.25,42.82
  Bottom 0.305: v45.25,42.82 47.23,40.83 47.23,36.46 LED3.A
  other vias: 45.54,34.77
PB11  (via drill 0.35)
  Top 0.305: IC1.22 45.46,43.55 45.91,43.1 45.91,42.41 45.5,42 43.53,42 v42.52,40.98
  Bottom 0.305: v42.52,40.98 40.19,38.66 LED7.A
  other vias: 40.19,34.77
PB12
  Top 0.305: IC1.25 47.95,43.24 44.2,39.5 35.5,39.5 34.75,38.75 28.9,38.75 28.86,38.71 28.81,38.71 24.62,34.52 23.42,34.52 22.73,33.83 22.73,10.9 15.31,3.48 JP1.1
PB13
  Top 0.305: IC1.26 49.02,48.38 51.81,45.6 51.81,41.39 46.66,36.24 44.45,36.24 LED4.A
PB14  (via drill 0.35)
  Top 0.305: LED5.A 39.68,36.7 45.85,36.7 50.16,41.02 v50.16,46.1 | v50.8,47.88 49.79,48.88 IC1.27
  Bottom 0.305: v50.16,46.1 50.8,46.74 v50.8,47.88
PB15
  Top 0.305: IC1.28 51.07,49.38 52.73,47.73 52.73,39.15 LED6.A
PC13
  Top 0.305: IC1.2 32.88,52.88 24.45,44.45 22.23,44.45 16.38,38.61 16.38,28.3 14.42,26.34 JP1.19
SPI3_MISO  (via drill 0.35)
  Top 0.305: IC1.40 44.96,58.65 v43.85,59.75
  Bottom 0.305: R11.2 22.02,70.3 Q1.2 29.47,70.3 34.16,65.6 34.16,62.89 37.3,59.75 v43.85,59.75
SPI3_MOSI  (via drill 0.35)
  Top 0.305: v43.8,58.8 44.46,58.14 IC1.41
  Bottom 0.305: v43.8,58.8 36.2,58.8 30.04,64.96 Q8.2 21.9,64.96 R25.2
SPI3_NSS  (via drill 0.35)
  Top 0.305: Q6.2 31.43,80.97 v32.55,79.85 | v44.7,66 45.96,64.74 IC1.38
  Bottom 0.305: Q6.2 22.28,80.97 R21.2 | v44.7,66 32.55,78.15 v32.55,79.85
  other vias: 23.97,80.97
SPI3_SCK  (via drill 0.35)
  Top 0.305: IC1.39 45.46,64.14 v43.7,65.9
  Bottom 0.305: R17.2 22.15,75.63 Q4.2 33.97,75.63 v43.7,65.9
SWCLK
  Top 0.305: SL1.2 49.23,9.55 49.23,24.34 55.75,30.86 55.75,51.58 51.56,55.77 47.35,55.77 IC1.37
SWDIO
  Top 0.305: IC1.34 54.1,52.38 54.81,51.67 54.81,30.82 48.64,24.64 48.64,14.04 SL1.4
USART1_CTS  (via drill 0.35)
  Top 0.305: IC1.32 52.63,51.38 v53.34,50.67
  Bottom 0.305: v53.34,50.67 57.7,50.67 58.67,51.65 58.67,66.93 61.27,69.53 FEP_1.P12
USART1_RTS  (via drill 0.35)
  Top 0.305: v53.98,51.44 53.52,51.88 IC1.33 | FEP_1.P13 60.46,68.14 58.61,68.14 v57.53,67.06
  Bottom 0.305: v53.98,51.44 54.48,51.44 57.53,54.48 v57.53,67.06
USART1_RX  (via drill 0.35)
  Top 0.305: IC1.31 51.98,50.88 v53.09,49.78
  Bottom 0.305: v53.09,49.78 58.6,49.78 59.69,50.87 59.69,62.87 61.27,64.44 FEP_1.P14
USART1_TX  (via drill 0.35)
  Top 0.305: IC1.30 51.47,50.38 v53.09,48.77
  Bottom 0.305: v53.09,48.77 59.44,48.77 61.59,50.93 61.59,61.89 FEP_1.P15

### Text on the board
bPlace: Miracle / / / Fry!!
tNames: 5V | 3V3 | ADC_0 | GND | ADC_1 | GND | 3V3 | STM32F302C8T6 | GND | 5V | ADC_2 | ADC_3 | 3V3 | GND | ADC_6 | 3V3 | GND | ADC_5 | 1_SCL | ADC_4 | 1_SDA | 3V3 | PC13 | GND | PA1 | PA2 | PB14 | PB11 | PB13 | PB10 | PB15 | GND | PA0 | Switch | PA3 | 3V3 | PA5 | 2_SCL | PA6 | 2_SDA | PA7 | GND | PB0 | SWO | NRST | SWDIO | GND | SWCLK | 3V3 | PB1 | PowerSuplly | PB2 | PB12
bNames: Controller_Keinz_2022